# EAGLE design power supply design (EAGLE 9.6.2)
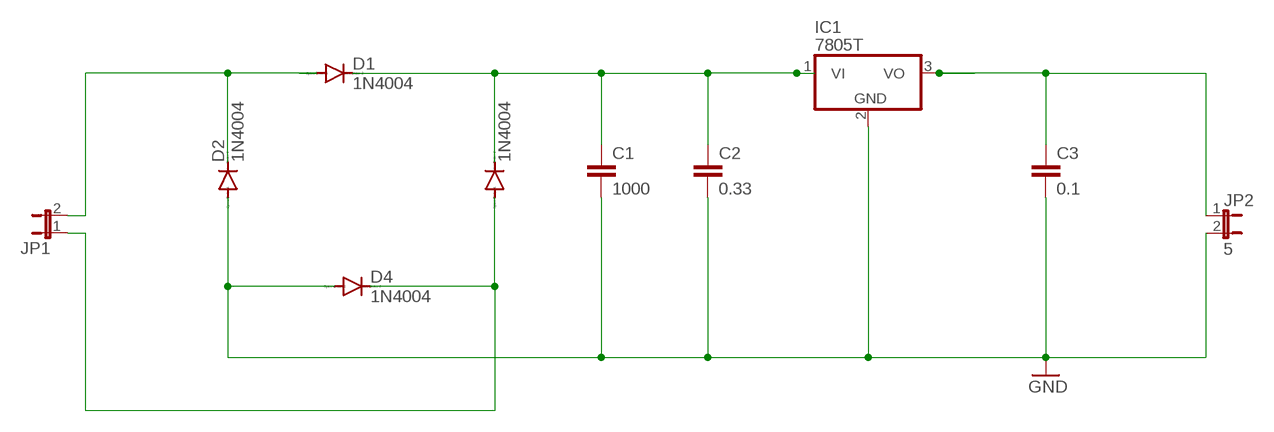
[diagram p0: schematic, sheet 1]

## Parts
C1  1000  C2,5-3  [C2.5-3]
C2  0.33  C2,5-3  [C2.5-3]
C3  0.1  C2,5-3  [C2.5-3]
D1  1N4004  [DO41-10]
D2  1N4004  [DO41-10]
D3  1N4004  [DO41-10]
D4  1N4004  [DO41-10]
IC1  7805T  [TO220H]
JP1  12  JP1E  [JP1]
JP2  5  JP1E  [JP1]

## Nets
GND: C1.2 C2.2 C3.2 D2.A D4.A IC1.2(GND) JP2.2
N$1: C3.1 IC1.3(VO) JP2.1
N$2: C1.1 C2.1 D1.C D3.C IC1.1(VI)
N$3: D1.A D2.C JP1.2
N$4: D3.A D4.C JP1.1

## Library data of the parts
C1-C3 = capacitor-wima:C: CAPACITOR naming: grid - package width
D1-D4 = diode:1N4004: DIODE general purpose rectifier, 1 A
IC1 = linear:78*: Positive VOLTAGE REGULATOR Source: http://cache.national.com/ds/LM/LM78L05.pdf http://www.fairchildsemi.com/ds/LM/LM7805.pdf
JP1 JP2 = jumper:JP1E: JUMPER

## Board
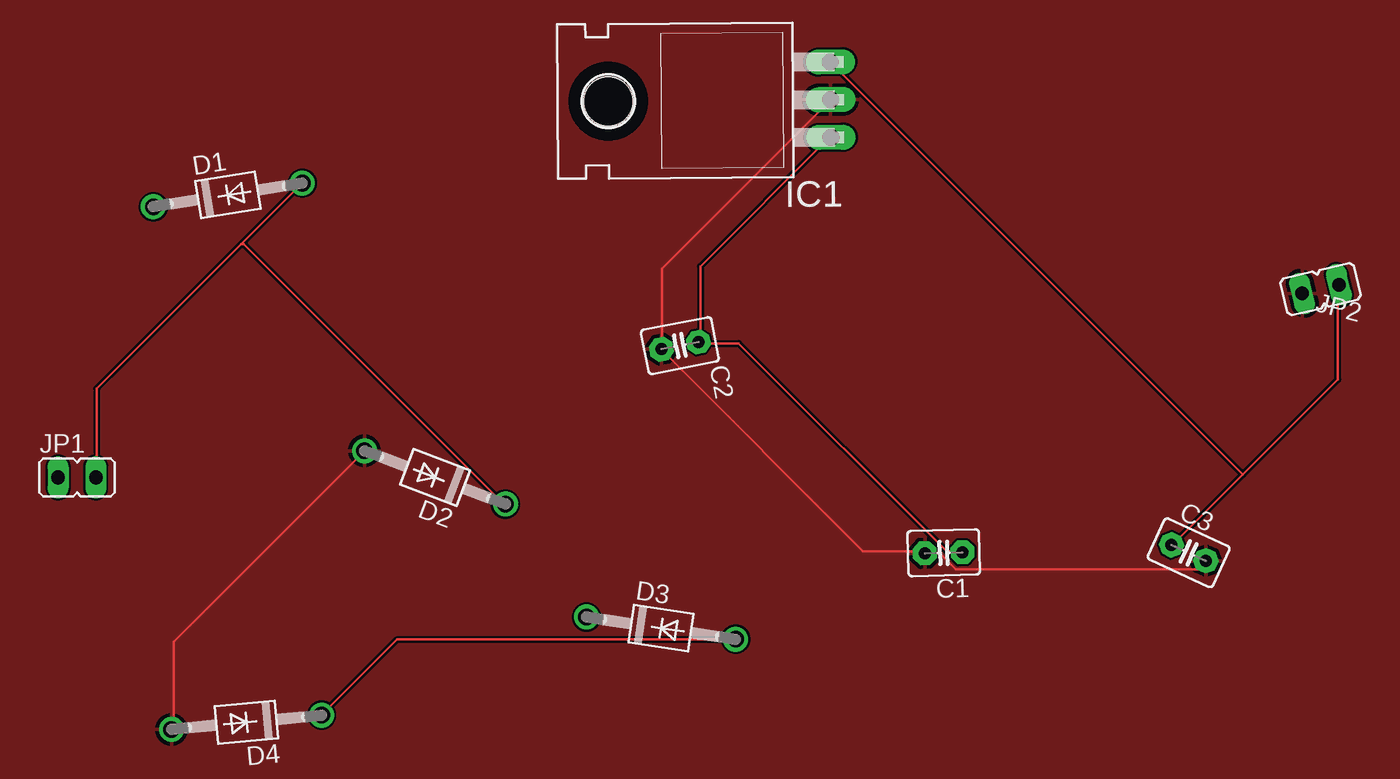
[diagram p1: board, top side]
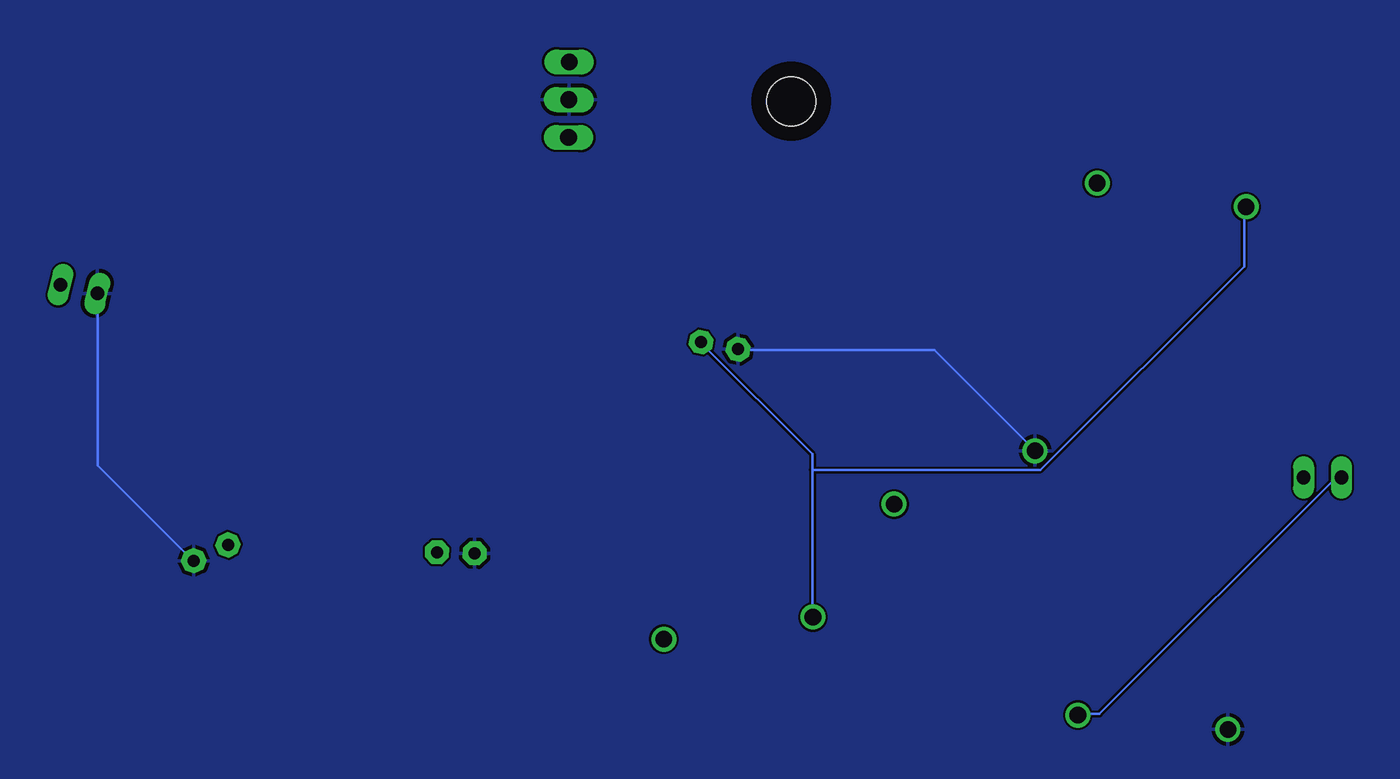
[diagram p2: board, bottom side, seen from below]

No outline drawn. Coordinates in mm, seen from the top.
Copper layers (1*16): Top 0.035mm / dielectric 1.5mm / Bottom 0.035mm
Design rules "default": minimum track width 6mil, minimum drill 0.35mm, track to track 6mil, track to pad 6mil, pad to pad 6mil, via to via 6mil, smd to smd 6mil, copper to edge 40mil, drill to drill 6mil, minimum pad ring 10mil, minimum via ring 8mil, stop-mask expansion 4mil, vias tented up to drill 0mil, thermal gap 10mil

### Footprints (pad centres in the part's own frame; a part is rotated, then mirrored left to right if it is on the bottom)
C2.5-3 = drill 0.813 pad 1.6 octagon: 1 -1.27,0; 2 1.27,0
DO41-10 = drill 1.118: A 5.08,0; C -5.08,0
TO220H = drill 1.118 long: 1 -2.54,-10.16; 2 0,-10.16; 3 2.54,-10.16 | hole 3.302: 0,4.826
JP1 = drill 0.914 long: 1 0,-1.27; 2 0,1.27

### Placement (x,y rotation side)
C1  59.69,31.75 181.5 top
C2  41.91,45.72 191 top
C3  76.2,31.75 335.2 top
D1  11.43,55.88 9 top
D2  25.4,36.83 159.3 top
D3  40.64,26.67 351.5 top
D4  12.7,20.32 185.4 top
IC1  41.91,62.23 90.4 top
JP1  1.27,36.83 270 top
JP2  85.09,49.53 103.4 top

### Tracks (layer width: path | path; a pad name or v marks a point on that pad's centre or on a via)
GND
  Top 0.152: C3.2 77.27,31.09 76.81,30.63 60.5,30.63 59.44,31.7 58.52,31.7 C1.2 58.37,31.85 54.25,31.85 40.69,45.41 C2.2 40.69,45.57 40.69,50.9 51.97,62.18 IC1.2 | D4.A 7.77,19.96 7.77,25.76 20.57,38.56 D2.A
  Bottom 0.152: JP2.2 83.82,49.23 83.82,37.64 77.42,31.24 C3.2 | C2.2 40.54,45.41 27.43,45.41 20.73,38.71 D2.A
  pour Top: -16.51,83.82 110.49,83.82 111.76,82.55 111.76,-13.97 110.49,-15.24 -13.97,-15.24 -16.51,-12.7 -16.51,82.55 -15.24,83.82
  pour Bottom: -40.64,92.71 121.92,92.71 129.54,92.71 129.54,-22.86 -45.72,-22.86 -45.72,-17.78 -45.72,92.71
N$1
  Top 0.152: 79.86,37.03 75.13,32.31 C3.1 | 79.86,37.03 86.26,43.43 86.26,49.68 JP2.1 | 79.86,37.03 52.12,64.77 IC1.3
N$2
  Top 0.152: IC1.1 51.97,59.74 43.28,51.05 43.28,46.02 C2.1 43.28,45.87 45.87,45.87 59.89,31.85 60.81,31.85 C1.1
  Bottom 0.152: 35.66,37.34 35.66,38.41 43.13,45.87 C2.1 | 35.66,37.34 35.66,27.43 D3.C | 35.66,37.34 20.27,37.34 6.55,51.05 6.55,55.02 D1.C
N$3
  Top 0.152: 12.34,52.58 16.31,56.54 D1.A | 12.34,52.58 2.59,42.82 2.59,36.88 JP1.2 | 12.34,52.58 12.5,52.58 30.02,35.05 D2.C
N$4
  Top 0.152: D3.A 45.57,25.91 22.86,25.91 17.83,20.88 D4.C
  Bottom 0.152: JP1.1 0,36.73 0.46,36.73 16.31,20.88 17.68,20.88 D4.C